# Altium schematic sheet carrier.SchDoc
size A3
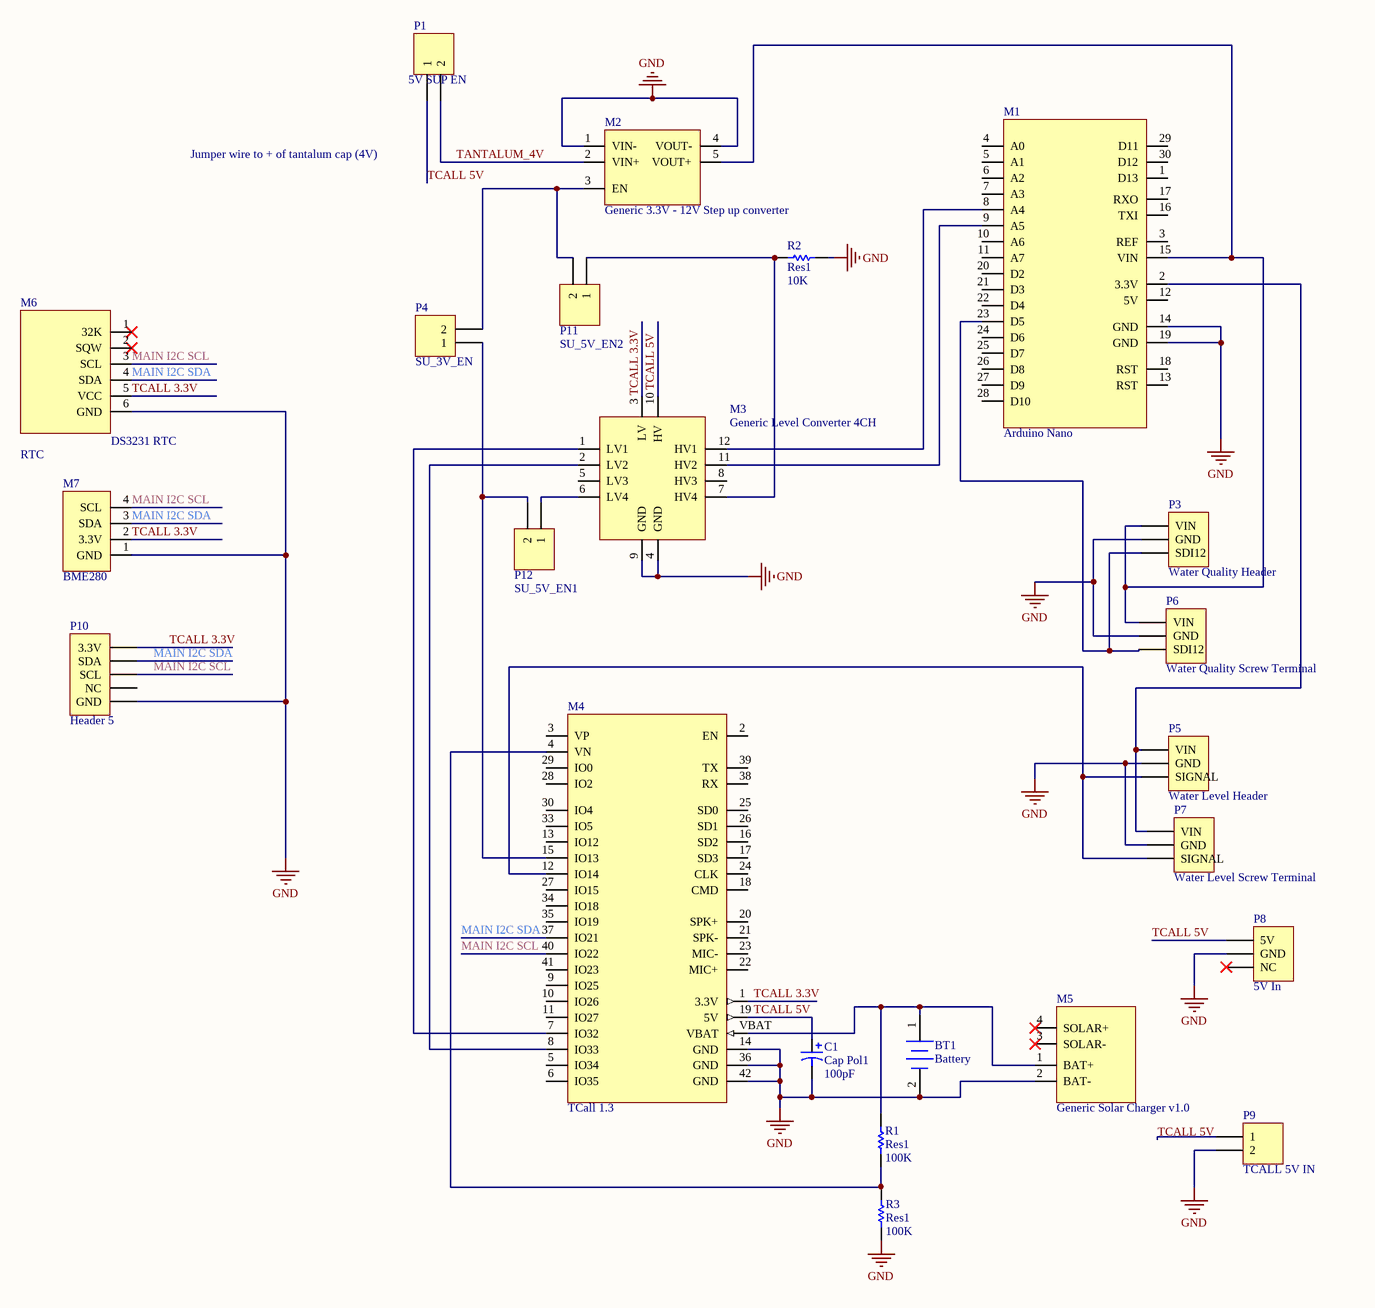
[diagram p0: carrier.SchDoc]

## Parts
BT1  Battery  [BAT-2]
C1  Cap Pol1  value 100pF  [RB7.6-15]
M1  Arduino Nano  [Arduino Nano]
M2  Generic 3.3V - 12V Step up converter  [Generic 3.3 - 12V step up]
M3  Generic Level Converter 4CH  [Generic Level Converter]
M4  TCall 1.3  [TCALL V1.3]
M5  Generic Solar Charger v1.0  [Generic solar charger]
M6  RTC  [GENERIC RTC Module]
M7  BME280  [Sparkfun BME280 Module]
P1  5V SUP EN  [HDR1X2]
P3  Water Quality Header  [HDR1X3]
P4  SU_3V_EN  [HDR1X2]
P5  Water Level Header  [HDR1X3]
P6  Water Quality Screw Terminal  [Terminal Block 3w 5mm]
P7  Water Level Screw Terminal  [Terminal Block 3w 5mm]
P8  5V In  [Terminal Block 3w 5mm]
P9  TCALL 5V IN  [HDR1X2]
P10  Header 5  [HDR1X5]
P11  SU_5V_EN2  [HDR1X2]
P12  SU_5V_EN1  [HDR1X2]
R1  Res1  value 100K  [AXIAL-0.3]
R2  Res1  value 10K  [AXIAL-0.3]
R3  Res1  value 100K  [AXIAL-0.3]

## Nets
GND: BT1.2(-) C1.2 M1.14(GND) M1.19(GND) M2.1(VIN-) M2.4(VOUT-) M3.4(GND) M3.9(GND) M4.14(GND) M4.36(GND) M4.42(GND) M5.2(BAT-) M6.6(GND) M7.1(GND) P3.2(GND) P5.2(GND) P6.2(GND) P7.2(GND) P8.2(GND) P9.2 P10.5(GND) R2.1 R3.1
MAIN I2C SCL: M4.40(IO22) M6.3(SCL) M7.4(SCL) P10.3(SCL)
MAIN I2C SDA: M4.37(IO21) M6.4(SDA) M7.3(SDA) P10.2(SDA)
TANTALUM_4V: M2.2(VIN+) P1.2
TCALL 3.3V: M3.3(LV) M4.1(3.3V) M6.5(VCC) M7.2(3.3V) P10.1(3.3V)
TCALL 5V: C1.1 M3.10(HV) M4.19(5V) P1.1 P8.1(5V) P9.1
NetBT1_1: BT1.1(+) M4.VBAT M5.1(BAT+) R1.2
NetM1_2: M1.2(3.3V) P5.1(VIN) P7.1(VIN)
NetM1_8: M1.8(A4) M3.12(HV1)
NetM1_9: M1.9(A5) M3.11(HV2)
NetM1_15: M1.15(VIN) M2.5(VOUT+) P3.1(VIN) P6.1(VIN)
NetM1_23: M1.23(D5) P3.3(SDI12) P6.3(SDI12)
NetM2_3: M2.3(EN) P4.2 P11.2
NetM3_1: M3.1(LV1) M4.7(IO32)
NetM3_2: M3.2(LV2) M4.8(IO33)
NetM3_6: M3.6(LV4) P12.1
NetM3_7: M3.7(HV4) P11.1 R2.2
NetM4_4: M4.4(VN) R1.1 R3.2
NetM4_12: M4.12(IO14) P5.3(SIGNAL) P7.3(SIGNAL)
NetM4_15: M4.15(IO13) P4.1 P12.2

Not connected (* = marked no-connect by the designer): M1 1(D13) 3(REF) 4(A0) 5(A1) 6(A2) 7(A3) 10(A6) 11(A7) 12(5V) 13(RST) 16(TXI) 17(RXO) 18(RST) 20(D2) 21(D3) 22(D4) 24(D6) 25(D7) 26(D8) 27(D9) 28(D10) 29(D11) 30(D12); M3 5(LV3) 8(HV3); M4 2(EN) 3(VP) 5(IO34) 6(IO35) 9(IO25) 10(IO26) 11(IO27) 13(IO12) 16(SD2) 17(SD3) 18(CMD) 20(SPK+) 21(SPK-) 22(MIC+) 23(MIC-) 24(CLK) 25(SD0) 26(SD1) 27(IO15) 28(IO2) 29(IO0) 30(IO4) 33(IO5) 34(IO18) 35(IO19) 38(RX) 39(TX) 41(IO23); M5 3(SOLAR-)* 4(SOLAR+)*; M6 1(32K)* 2(SQW)*; P8 3(NC)*; P10 4(NC)

## Notes on the sheet
- Jumper wire to + of tantalum cap (4V)
- (in symbol Generic RTC Module) DS3231 RTC

## Library data of the parts
BT1 = Battery: Multicell Battery; Published: 24-Mar-1999; LatestRevisionDate: 17-Jul-2002; LatestRevisionNote: Re-released for DXP Platform.; PackageReference: BAT-2; Publisher: Altium Limited; PackageDescription: Battery; 2 Leads
C1 = Cap Pol1: Polarized Capacitor (Radial); Published: 8-Jun-2000; LatestRevisionDate: 17-Jul-2002; LatestRevisionNote: Re-released for DXP Platform.; PackageReference: RB7.6-15; Publisher: Altium Limited; PackageDescription: Polarized Capacitor (Radial); 2 Leads
M6 = Generic RTC Module
M7 = Sparkfun BME280 Module
P1 P4 P9 P11 P12 = Header 2: Header, 2-Pin; LatestRevisionDate: 17-Jul-2002; LatestRevisionNote: Re-released for DXP Platform.; Publisher: Altium Limited
P3 = Header 3: Water Ql.; LatestRevisionDate: 17-Jul-2002; LatestRevisionNote: Re-released for DXP Platform.; Publisher: Altium Limited
P5-P8 = Header 3: Header, 3-Pin; LatestRevisionDate: 17-Jul-2002; LatestRevisionNote: Re-released for DXP Platform.; Publisher: Altium Limited
P10 = Header 5: Header, 5-Pin; LatestRevisionDate: 17-Jul-2002; LatestRevisionNote: Re-released for DXP Platform.; Publisher: Altium Limited
R1-R3 = Res1: Resistor; Published: 8-Jun-2000; LatestRevisionDate: 17-Jul-2002; LatestRevisionNote: Re-released for DXP Platform.; PackageReference: AXIAL-0.3; Publisher: Altium Limited; PackageDescription: Axial Device, Thru-Hole; 2 Leads; 0.3 in Pin Spacing